# Altium schematic sheet MCU.SchDoc
size A
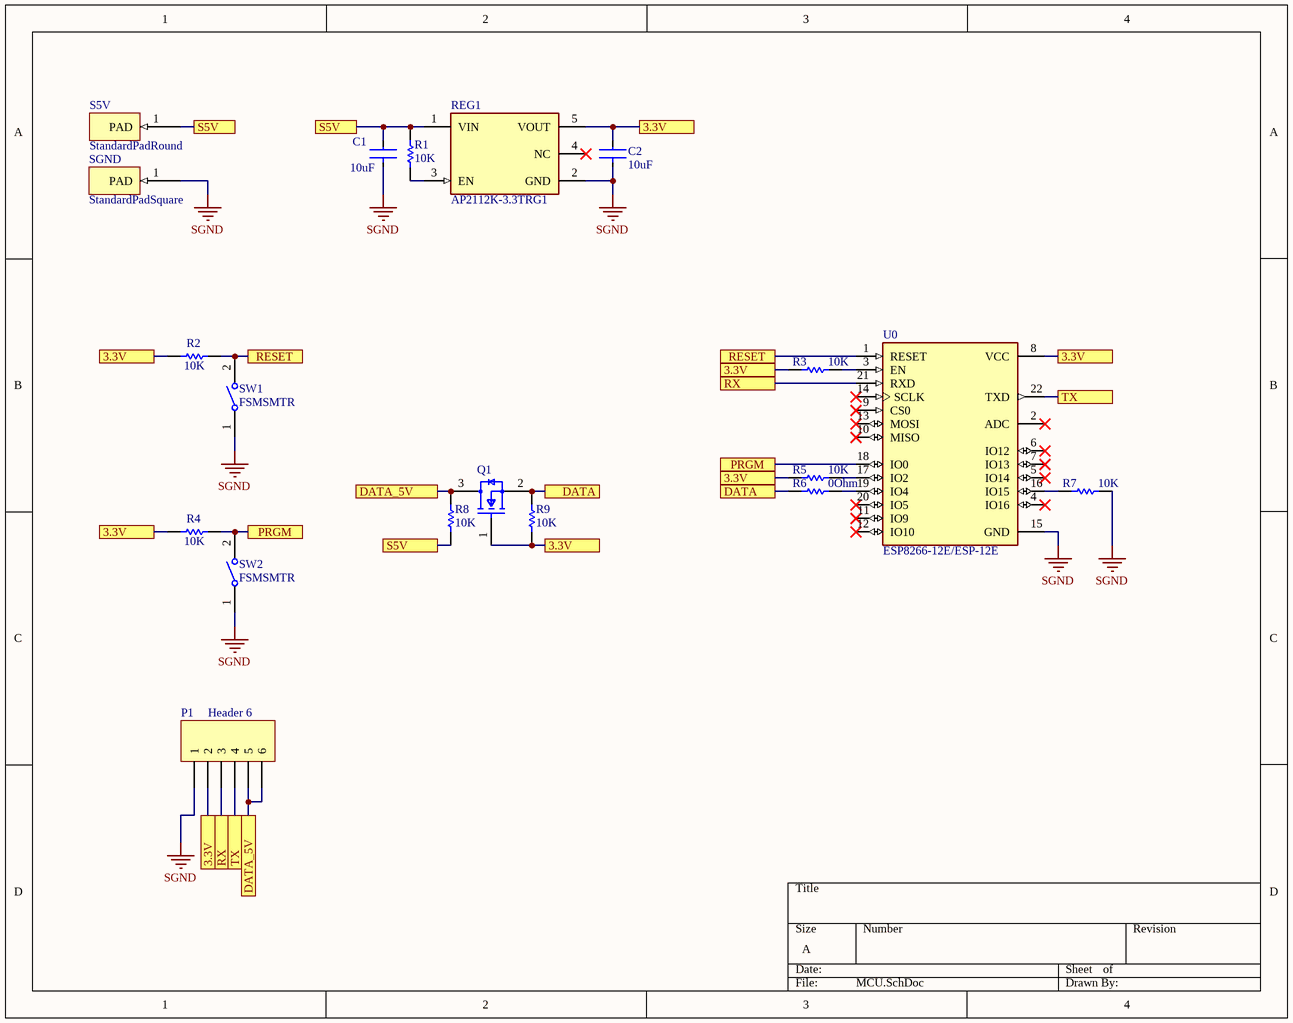
[diagram p0: MCU.SchDoc]

## Parts
C1  value 10uF  [FP-CC0805-0_85-MFG]  (hidden comment: CC0805KKX7R6BB105)
C2  value 10uF  [FP-CC0805-0_85-MFG]  (hidden comment: CC0805KKX7R6BB105)
P1  Header 6  [HDR1X6]
Q1  BSS138  [FP-318-08-IPC_B]  (value not drawn)
R1  value 10K  [RESC2013X50X30LL20T20]  (hidden comment: CRCW08050000Z0EA)
R2  value 10K  [RESC2013X50X30LL20T20]  (hidden comment: CRCW08050000Z0EA)
R3  value 10K  [RESC2013X50X30LL20T20]  (hidden comment: CRCW08050000Z0EA)
R4  value 10K  [RESC2013X50X30LL20T20]  (hidden comment: CRCW08050000Z0EA)
R5  value 10K  [RESC2013X50X30LL20T20]  (hidden comment: CRCW08050000Z0EA)
R6  value 0Ohm  [RESC2013X50X30LL20T20]  (hidden comment: CRCW08050000Z0EA)
R7  value 10K  [RESC2013X50X30LL20T20]  (hidden comment: CRCW08050000Z0EA)
R8  10K  [RESC2013X50X30ML20T20]
R9  10K  [RESC2013X50X30ML20T20]
REG1  AP2112K-3.3TRG1  [FP-SOT25-IPC_A]
S5V  StandardPadRound  [StandardPadRound-Footprint-1]
SGND  StandardPadSquare  [StandardPadSquare-Footprint-1]
SW1  FSMSMTR  [TECO-FSMSMTR_V]
SW2  FSMSMTR  [TECO-FSMSMTR_V]
U0  ESP8266-12E/ESP-12E  [XCVR_ESP8266-12E%2FESP-12E]

## Ports
3.3V, DATA, DATA_5V, PRGM, RESET, RX, S5V, TX

## Nets
SGND: C1.1 C2.1 P1.1 R7.2 REG1.2(GND) SGND.1(PAD) SW1.1 SW2.1 U0.15(GND)
3.3V: C2.2 P1.2 Q1.1(G) R2.1 R3.1 R4.1 R5.1 R9.1 REG1.5(VOUT) U0.8(VCC) ; port 3.3V
DATA: Q1.2(S) R6.1 R9.2 ; port DATA
DATA_5V: P1.5 P1.6 Q1.3(D) R8.2 ; port DATA_5V
PRGM: R4.2 SW2.2 U0.18(IO0) ; port PRGM
RESET: R2.2 SW1.2 U0.1(RESET) ; port RESET
RX: P1.3 U0.21(RXD) ; port RX
S5V: C1.2 R1.2 R8.1 REG1.1(VIN) S5V.1(PAD) ; port S5V
TX: P1.4 U0.22(TXD) ; port TX
NetR1_1: R1.1 REG1.3(EN)
NetR3_2: R3.2 U0.3(EN)
NetR5_2: R5.2 U0.17(IO2)
NetR6_2: R6.2 U0.19(IO4)
NetR7_1: R7.1 U0.16(IO15)

Not connected (* = marked no-connect by the designer): REG1 4(NC)*; U0 2(ADC)* 4(IO16)* 5(IO14)* 6(IO12)* 7(IO13)* 9(CS0)* 10(MISO)* 11(IO9)* 12(IO10)* 13(MOSI)* 14(SCLK)* 20(IO5)*

## Library data of the parts
C1 C2 = CMP-03422-000182-1: CAP CER 1UF 10V X7R 0805; Manufacturer: Yageo; Material: Ceramic; Tolerance: 0.1; ComponentLink2URL: http://www.yageo.com/documents/recent/UPY-GPHC_Y5V_6.3V-to-50V_8.pdf; Automotive: No; Temperature Range Low: -30°C; Octopart: https://octopart.com/cc0805kkx7r6bb105-yageo-42522859; Temperature Characteristic: X7R; RoHS: TRUE; Voltage Rating: 10 V; Capacitance: 1 uF; Package: CC0805-0.85; Device Class L3: Ceramic Capacitors; Category: Cap; Mouser Description: Multilayer Ceramic Capacitors MLCC - SMD/SMT 1.0uF 10V X7R 10%; Temperature Range High: +85°C; Ipc Land Pattern Name: CAPC200125X85; Manufacturer Part Number: CC0805KKX7R6BB105; ComponentLink2Description: Datasheet; Temperature: -30°C to +85°C; Height: 0.95mm; Lead Free: Yes; Device Class L1: Passive Components; Device Class L2: Capacitors; Footprint Url: http://www.yageo.com/exep/pages/download/literatures/UPY-C_GEN_24.pdf; Digikey Description: CAP CER 1UF 10V X7R 0805
P1 = CMP-049-0107-1: Header, 6-Pin; Signal Integrity: Connector; LatestRevisionNote: Re-released for DXP Platform.; LatestRevisionDate: 17-Jul-2002; Design Item ID: Header 6; Pin Count: 6; Publisher: Altium Limited; Source: Miscellaneous Connectors.SchLib; Component Type: Standard
Q1 = CMP-07173-000101-1: MOSFET N-CH 50V 220MA SOT-23; Turn-Off Delay Time: 20ns; Element Configuration: Single; Rds On Max: 3.5R; Gate to Source Voltage (Vgs): 20V; Threshold Voltage: 1.3V; Number of Elements: 1; Power Dissipation: 360mW; Rise Time: 9ns; Turn-On Delay Time: 2.5ns; Input Capacitance: 27pF; On-State Resistance: 6R; Lead Free: Lead Free; Length: 2.92mm; Width: 1.3mm; Drain to Source Breakdown Voltage: 50V; Min Operating Temperature: -55°C; REACH SVHC: No SVHC; Packaging: Tape and Reel; Radiation Hardening: No; Height: 0.93mm; Drain to Source Voltage (Vdss): 50V; Current Rating: 220mA; Voltage Rating (DC): 50V; Weight: 0.03g; Continuous Drain Current (ID): 220mA; Number of Pins: 3; Nominal Vgs: 1.3V; Max Power Dissipation: 360mW; Fall Time: 9ns; Drain to Source Resistance: 3.5R; Contact Plating: Tin; Case/Package: SOT-23; Package Quantity: 1; Dual Supply Voltage: 50V; Mount: Surface Mount; Termination: SMD/SMT; Max Operating Temperature: 150°C
R1-R7 = CMP-2001-04896-1: 0805; Manufacturer: Vishay Dale; Part Number: CRCW08050000Z0EA
R8 R9 = CMP-2001-03735-1: Part Number: CRCW0805270RFKEA; Manufacturer: Vishay Dale
REG1 = CMP-12756-000035-1: IC REG LINEAR 3.3V 600MA SOT25; Number of Regulators: 1; Output Type: Fixed; Polarity: Positive; Min Input Voltage: 2.5V; Max Input Voltage: 6V; Accuracy: 1.5%; Quiescent Current: 55uA; Dropout Voltage: 250mV; Min Operating Temperature: -40°C; Length: 3.1mm; Output Current: 600mA; Max Operating Temperature: 85°C; Package Quantity: 1; Output Voltage: 3.3V; Width: 1.7mm; Number of Outputs: 1; Packaging: Tape and Reel; Height: 1.3mm; Lead Free: Lead Free; Max Output Current: 600mA; Case/Package: SOT-23-5; Mount: Surface Mount; Number of Pins: 5
S5V = CMP-000003-1: 1.9mm x 1.9mm round pad with a 1mm hole
SGND = CMP-000004-1: 1.9mm X 1.9mm square pad with 1mm hole
SW1 SW2 = CMP-2000-07501-1: FSMSM Push Button Switch, 50 mA, -35 to 85 degC, 2-Pin SMD, RoHS, Tape and Reel; Manufacturer: TE Connectivity; Voltage Rating (DC): 24V; Electrical Life: 20000Cycles; Operating Force: 180gf; Switch Travel: 0.25mm; Contact Current Rating: 50mA; Case\/Package: SMD/SMT; Actuator Length: 1.07mm; Throw Configuration: SPST; Actuator Material: Polyamide; Contact Resistance: 100mOhm; Illumination Type: Illuminated; Max Voltage Rating (DC): 12V; Manufacturer URL: http://www.te.com/; Lead Free: LeadFree; Packaging: TapeandReel; Min Operating Temperature: -35degC; Mechanical Life: 20000Cycles; Mount: SurfaceMount; REACH SVHC: Unknown; Package Quantity: 1800; Package Reference: FSMSMTR; RoHSCompliant: true; Max Operating Temperature: 85degC; Orientation: Straight; ELV: Compliant; Datasheet URL: http://www.te.com/commerce/DocumentDelivery/DDEController?Action=showdoc&DocId=Customer+Drawing%7F1437566-3%7FC2%7Fpdf%7FEnglish%7FENG_CD_1437566-3_C2_1437566_3_1_c.dwg.pdf%7F1437566-4; Package Description: 2-Pin Surface Mount Device, Body 6 x 3.5 mm, Pitch 9.19 mm; Current Rating: 50mA; Contact Plating: Silver; Termination: GullWing; Datasheet Version: Rev. C2, 08/2014; Contact Material: Brass; Mounting Technology: SurfaceMount
U0 = CMP-052-0000-2: This WiFi module has a 32-bit MCU micro and clock speeds supporting 80 MHz or 160 MHz. Supports the RTOS and integrated Wi-Fi MAC/BB/RF/PA/LNA, and has an on-board antenna.; MF: AI-Thinker; Design Item ID: ESP8266-12E/ESP-12E; Availability: Unavailable; Source: SnapEDAsch.SchLib; SnapEDA_Link: https://www.snapeda.com/parts/ESP8266-12E/ESP-12E/AI-Thinker/view-part/106414/?ref=snap; Value: *; Component Type: Standard; Price: None; Pin Count: 22; Package: None; MP: ESP8266-12E/ESP-12E